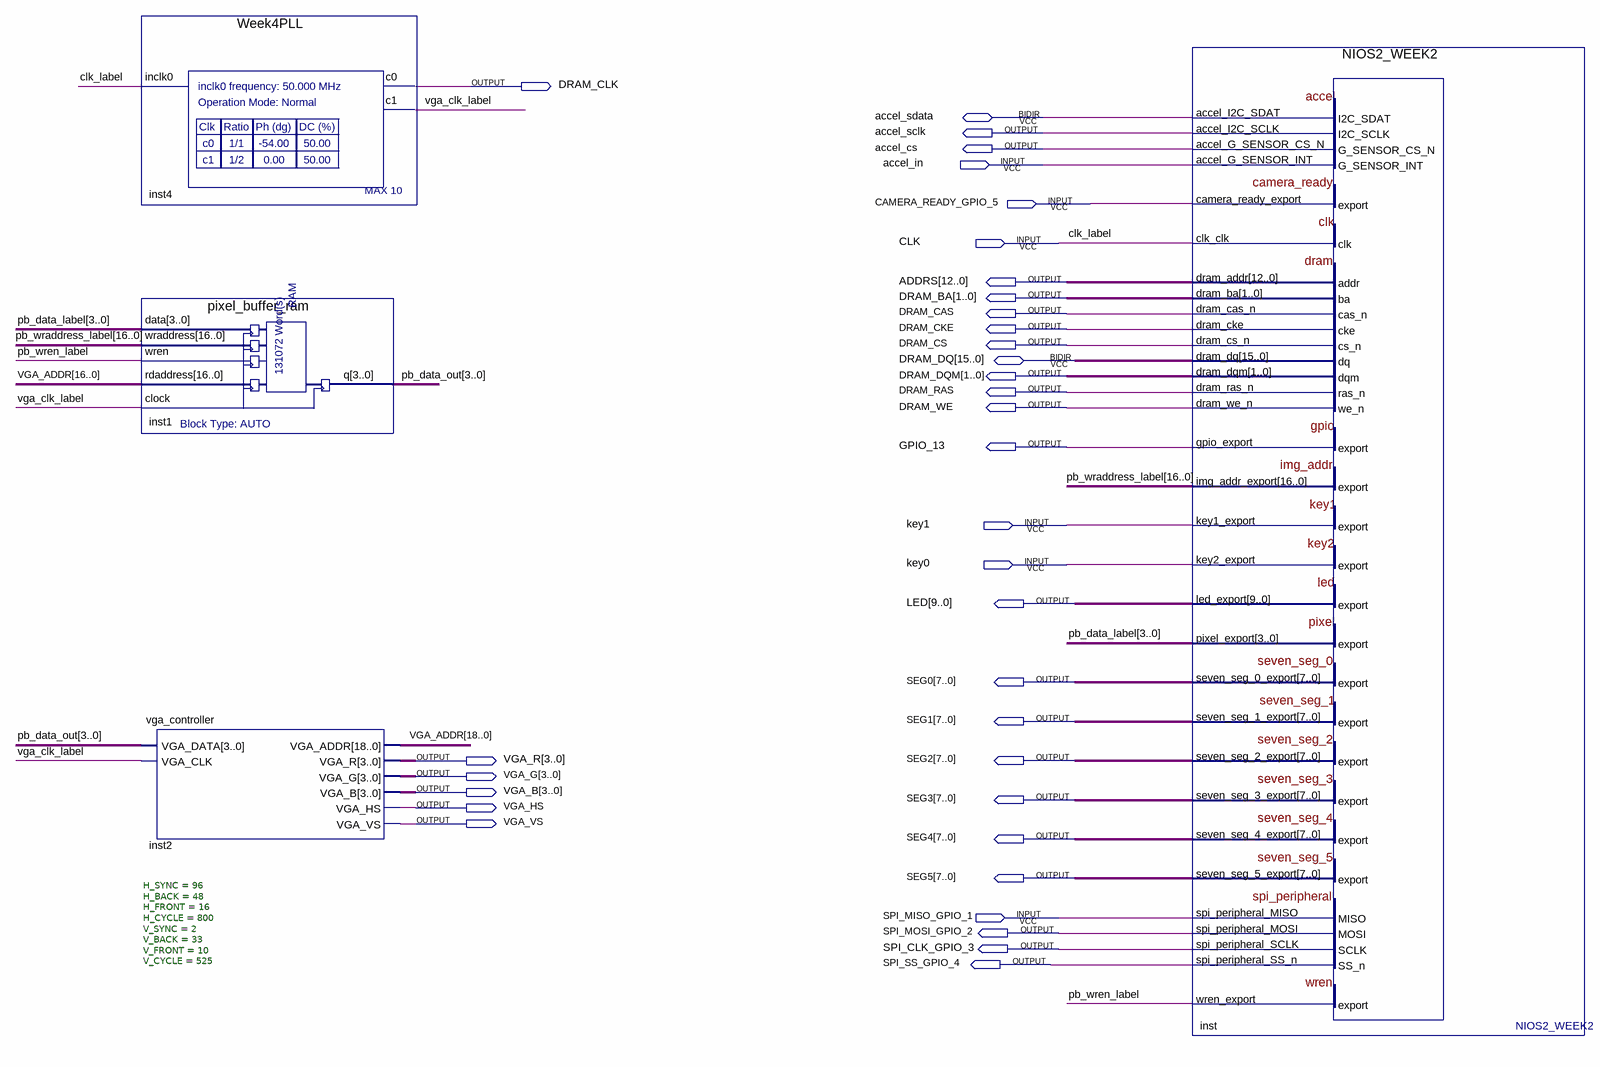
[diagram p0: schematic sheet]
// Quartus schematic Week3_Lab.bdf as structural Verilog: 4 symbols, 35 pins
module Week3_Lab (
  input  accel_in,
  input  CAMERA_READY_GPIO_5,
  input  CLK,
  input  key1,
  input  key0,
  input  SPI_MISO_GPIO_1,
  inout  accel_sdata,
  inout  [15:0] DRAM_DQ,
  output DRAM_CLK,
  output accel_sclk,
  output accel_cs,
  output [12:0] ADDRS,
  output [1:0] DRAM_BA,
  output DRAM_CAS,
  output DRAM_CKE,
  output DRAM_CS,
  output [1:0] DRAM_DQM,
  output DRAM_RAS,
  output DRAM_WE,
  output GPIO_13,
  output [9:0] LED,
  output [7:0] SEG0,
  output [7:0] SEG1,
  output [3:0] VGA_R,
  output [7:0] SEG2,
  output [3:0] VGA_G,
  output [3:0] VGA_B,
  output [7:0] SEG3,
  output VGA_HS,
  output VGA_VS,
  output [7:0] SEG4,
  output [7:0] SEG5,
  output SPI_MOSI_GPIO_2,
  output SPI_CLK_GPIO_3,
  output SPI_SS_GPIO_4
);

  wire pb_wren_label, vga_clk_label;
  wire [3:0] pb_data_label, pb_data_out;
  wire [16:0] pb_wraddress_label;
  wire [18:0] VGA_ADDR;

  Week4PLL inst4 (.inclk0(CLK), .c0(DRAM_CLK), .c1(vga_clk_label));
  pixel_buffer_ram inst1 (
    .data(pb_data_label), .wraddress(pb_wraddress_label), .wren(pb_wren_label), .rdaddress(VGA_ADDR[16:0]),
    .clock(vga_clk_label), .q(pb_data_out));
  vga_controller #(.H_SYNC(96), .H_BACK(48), .H_FRONT(16), .H_CYCLE(800), .V_SYNC(2), .V_BACK(33), .V_FRONT(10), .V_CYCLE(525)) inst2 (
    .VGA_DATA(pb_data_out), .VGA_CLK(vga_clk_label), .VGA_ADDR(VGA_ADDR), .VGA_R(VGA_R), .VGA_G(VGA_G),
    .VGA_B(VGA_B), .VGA_HS(VGA_HS), .VGA_VS(VGA_VS));
  NIOS2_WEEK2 inst (
    .accel_G_SENSOR_INT(accel_in), .camera_ready_export(CAMERA_READY_GPIO_5), .clk_clk(CLK),
    .key1_export(key1), .key2_export(key0), .spi_peripheral_MISO(SPI_MISO_GPIO_1),
    .accel_I2C_SCLK(accel_sclk), .accel_G_SENSOR_CS_N(accel_cs), .dram_addr(ADDRS), .dram_ba(DRAM_BA),
    .dram_cas_n(DRAM_CAS), .dram_cke(DRAM_CKE), .dram_cs_n(DRAM_CS), .dram_dqm(DRAM_DQM),
    .dram_ras_n(DRAM_RAS), .dram_we_n(DRAM_WE), .gpio_export(GPIO_13), .img_addr_export(pb_wraddress_label),
    .led_export(LED), .pixel_export(pb_data_label), .seven_seg_0_export(SEG0), .seven_seg_1_export(SEG1),
    .seven_seg_2_export(SEG2), .seven_seg_3_export(SEG3), .seven_seg_4_export(SEG4),
    .seven_seg_5_export(SEG5), .spi_peripheral_MOSI(SPI_MOSI_GPIO_2), .spi_peripheral_SCLK(SPI_CLK_GPIO_3),
    .spi_peripheral_SS_n(SPI_SS_GPIO_4), .wren_export(pb_wren_label), .accel_I2C_SDAT(accel_sdata),
    .dram_dq(DRAM_DQ));

  // Other names for the same wires on the sheet: clk_label = CLK
endmodule
